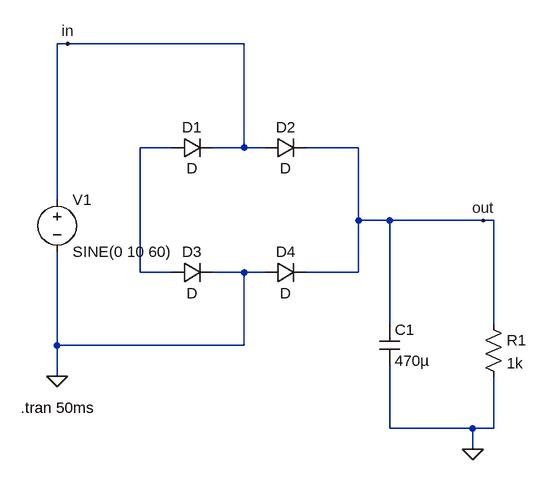
[diagram p0: schematic Assignment 3-2 - add one capacitor.asc]
Assignment 3-2 - add one capacitor.asc, the LTspice schematic file:
Version 4.1
SHEET 1 880 680
WIRE 48 -96 32 -96
WIRE 320 -96 48 -96
WIRE 208 64 160 64
WIRE 320 64 320 -96
WIRE 320 64 272 64
WIRE 352 64 320 64
WIRE 496 64 416 64
WIRE 32 144 32 -96
WIRE 496 176 496 64
WIRE 544 176 496 176
WIRE 688 176 544 176
WIRE 704 176 688 176
WIRE 160 256 160 64
WIRE 208 256 160 256
WIRE 320 256 272 256
WIRE 352 256 320 256
WIRE 496 256 496 176
WIRE 496 256 416 256
WIRE 544 336 544 176
WIRE 704 336 704 176
WIRE 32 368 32 224
WIRE 320 368 320 256
WIRE 320 368 32 368
WIRE 32 416 32 368
WIRE 544 496 544 400
WIRE 672 496 544 496
WIRE 704 496 704 416
WIRE 704 496 672 496
WIRE 672 528 672 496
FLAG 32 416 0
FLAG 672 528 0
FLAG 48 -96 in
FLAG 688 176 out
SYMBOL voltage 32 128 R0
WINDOW 123 0 0 Left 0
WINDOW 39 0 0 Left 0
SYMATTR InstName V1
SYMATTR Value SINE(0 10 60)
SYMBOL diode 208 80 R270
WINDOW 0 32 32 VTop 2
WINDOW 3 0 32 VBottom 2
SYMATTR InstName D1
SYMBOL diode 352 80 R270
WINDOW 0 32 32 VTop 2
WINDOW 3 0 32 VBottom 2
SYMATTR InstName D2
SYMBOL diode 208 272 R270
WINDOW 0 32 32 VTop 2
WINDOW 3 0 32 VBottom 2
SYMATTR InstName D3
SYMBOL diode 352 272 R270
WINDOW 0 32 32 VTop 2
WINDOW 3 0 32 VBottom 2
SYMATTR InstName D4
SYMBOL cap 528 336 R0
SYMATTR InstName C1
SYMATTR Value 470µ
SYMBOL res 688 320 R0
SYMATTR InstName R1
SYMATTR Value 1k
TEXT -24 464 Left 2 !.tran 50ms

The netlist it stands for:
* Assignment 3-2 - add one capacitor.asc
V1 in 0 SINE(0 10 60)
D1 N001 in D
D2 in out D
D3 N001 0 D
D4 0 out D
C1 out 0 470µ
R1 out 0 1k
.model D D
.lib standard.dio
.tran 50ms
.backanno
.end